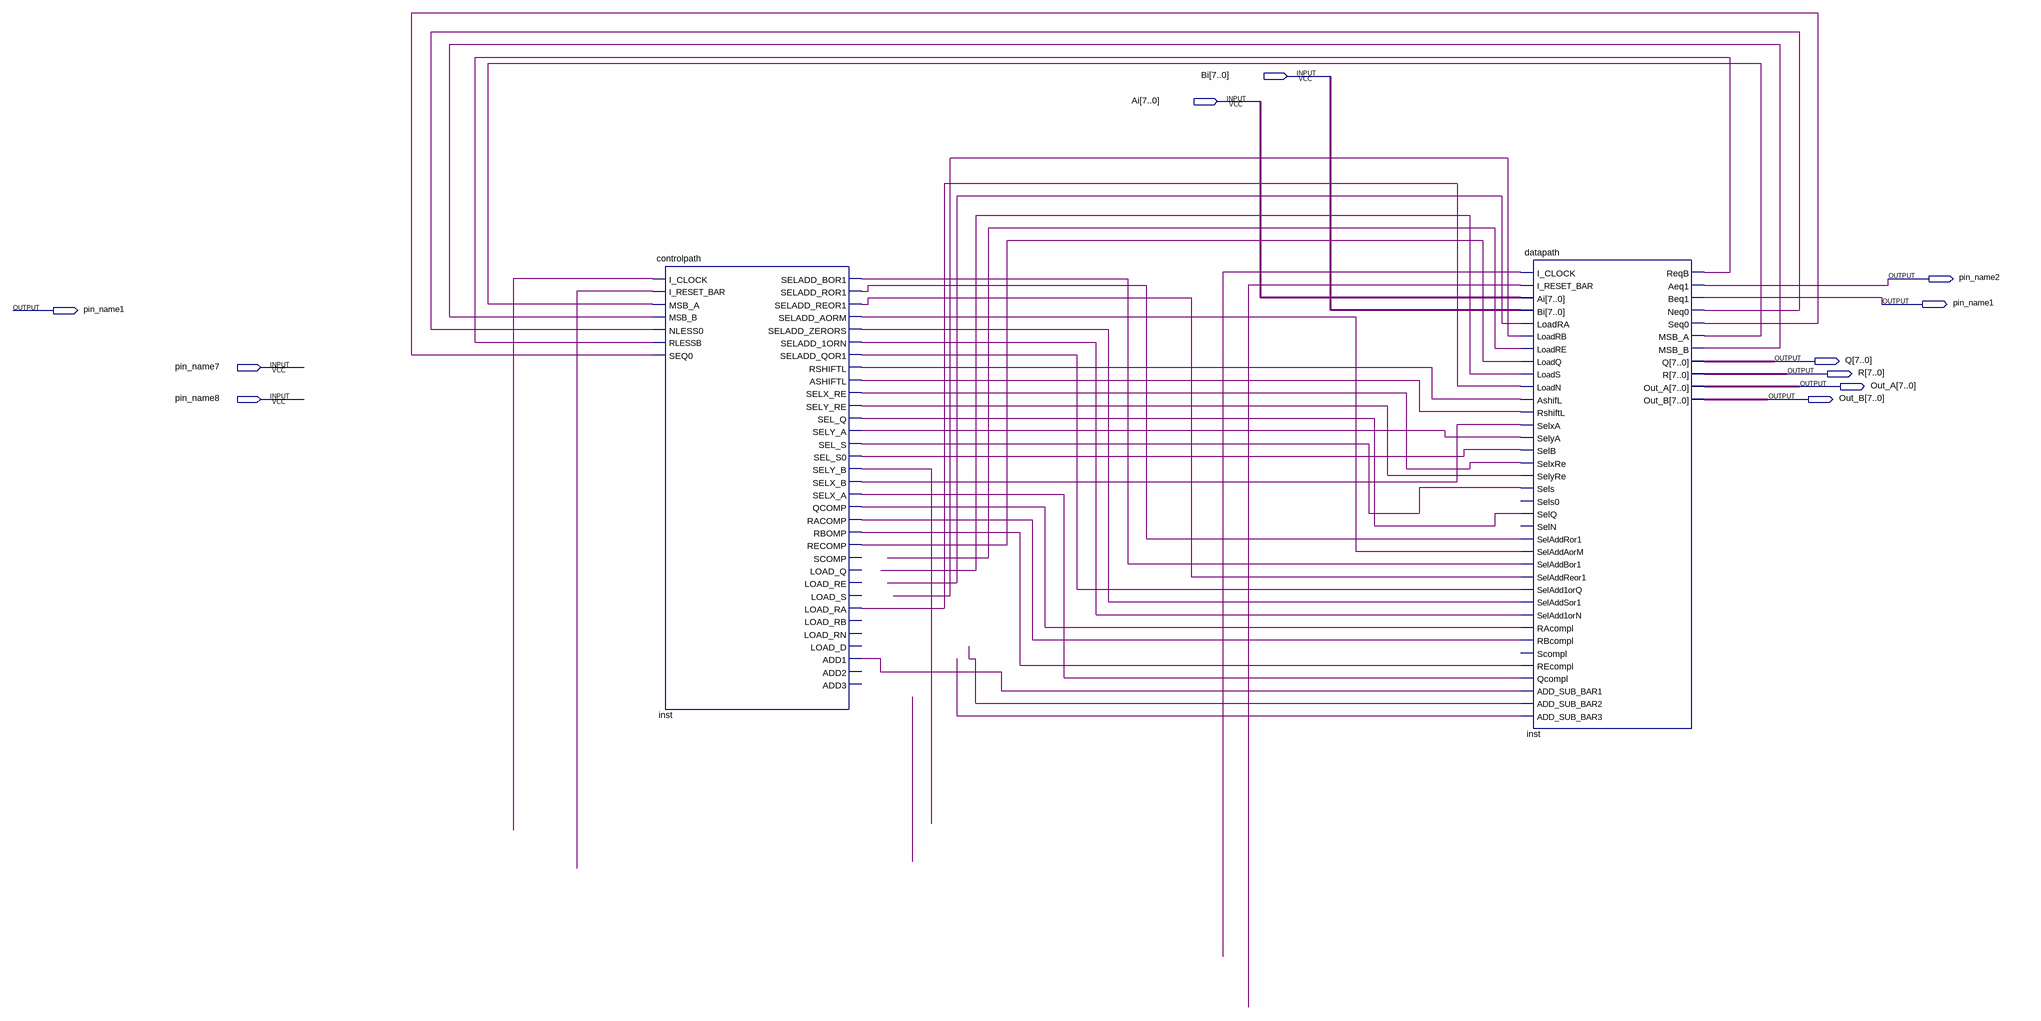
[diagram p0: schematic sheet]
// Quartus schematic div_top.bdf as structural Verilog: 2 symbols, 11 pins
module div_top (
  input  [7:0] Bi,
  input  [7:0] Ai,
  input  pin_name7,
  input  pin_name8,
  output pin_name2,
  output pin_name1,
  output [7:0] Q,
  output [7:0] R,
  output [7:0] Out_A,
  output [7:0] Out_B
);

  wire inst_add1, inst_ashiftl, inst_load_ra, inst_msb_a, inst_msb_b, inst_neq0, inst_qcomp, inst_racomp,
       inst_rbomp, inst_recomp, inst_reqb, inst_rshiftl, inst_sel_q, inst_sel_s, inst_sel_s0,
       inst_seladd_1orn, inst_seladd_aorm, inst_seladd_bor1, inst_seladd_qor1, inst_seladd_reor1,
       inst_seladd_ror1, inst_seladd_zerors, inst_selx_a, inst_selx_b, inst_selx_re, inst_sely_a,
       inst_sely_b, inst_sely_re, inst_seq0, undriven, undriven_2, undriven_3, undriven_4, undriven_5,
       undriven_6, undriven_7, undriven_8, undriven_9, undriven_10;

  controlpath inst (
    .I_CLOCK(undriven_9), .I_RESET_BAR(undriven_10), .MSB_A(inst_msb_a), .MSB_B(inst_msb_b),
    .NLESS0(inst_neq0), .RLESSB(inst_reqb), .SEQ0(inst_seq0), .SELADD_BOR1(inst_seladd_bor1),
    .SELADD_ROR1(inst_seladd_ror1), .SELADD_REOR1(inst_seladd_reor1), .SELADD_AORM(inst_seladd_aorm),
    .SELADD_ZERORS(inst_seladd_zerors), .SELADD_1ORN(inst_seladd_1orn), .SELADD_QOR1(inst_seladd_qor1),
    .RSHIFTL(inst_rshiftl), .ASHIFTL(inst_ashiftl), .SELX_RE(inst_selx_re), .SELY_RE(inst_sely_re),
    .SEL_Q(inst_sel_q), .SELY_A(inst_sely_a), .SEL_S(inst_sel_s), .SEL_S0(inst_sel_s0), .SELY_B(inst_sely_b),
    .SELX_B(inst_selx_b), .SELX_A(inst_selx_a), .QCOMP(inst_qcomp), .RACOMP(inst_racomp), .RBOMP(inst_rbomp),
    .RECOMP(inst_recomp), .LOAD_RA(inst_load_ra), .ADD1(inst_add1));  // open: SCOMP, LOAD_Q, LOAD_RE, LOAD_S, LOAD_RB, LOAD_RN, LOAD_D, ADD2, ADD3
  datapath inst_dup2 (
    .I_CLOCK(undriven_7), .I_RESET_BAR(undriven_8), .Ai(Ai), .Bi(Bi), .LoadRA(undriven_3),
    .LoadRB(undriven_4), .LoadRE(undriven), .LoadQ(inst_recomp), .LoadS(undriven_2), .LoadN(inst_load_ra),
    .AshifL(inst_rshiftl), .RshiftL(inst_ashiftl), .SelxA(inst_selx_b), .SelyA(inst_sely_a),
    .SelB(inst_sel_s0), .SelxRe(inst_selx_re), .SelyRe(inst_sely_re), .Sels(inst_sel_s), .SelQ(inst_sel_q),
    .SelAddRor1(inst_seladd_ror1), .SelAddAorM(inst_seladd_aorm), .SelAddBor1(inst_seladd_bor1),
    .SelAddReor1(inst_seladd_reor1), .SelAdd1orQ(inst_seladd_qor1), .SelAddSor1(inst_seladd_zerors),
    .SelAdd1orN(inst_seladd_1orn), .RAcompl(inst_qcomp), .RBcompl(inst_racomp), .REcompl(inst_rbomp),
    .Qcompl(inst_selx_a), .ADD_SUB_BAR1(inst_add1), .ADD_SUB_BAR2(undriven_5), .ADD_SUB_BAR3(undriven_6),
    .ReqB(inst_reqb), .Aeq1(pin_name2), .Beq1(pin_name1), .Neq0(inst_neq0), .Seq0(inst_seq0),
    .MSB_A(inst_msb_a), .MSB_B(inst_msb_b), .Q(Q), .R(R), .Out_A(Out_A), .Out_B(Out_B));  // open: Sels0, SelN, Scompl
endmodule
